# Altium schematic sheet LED_PORT.SchDoc
size A; DocumentNumber: 6; SheetNumber: 6; SheetTotal: 7
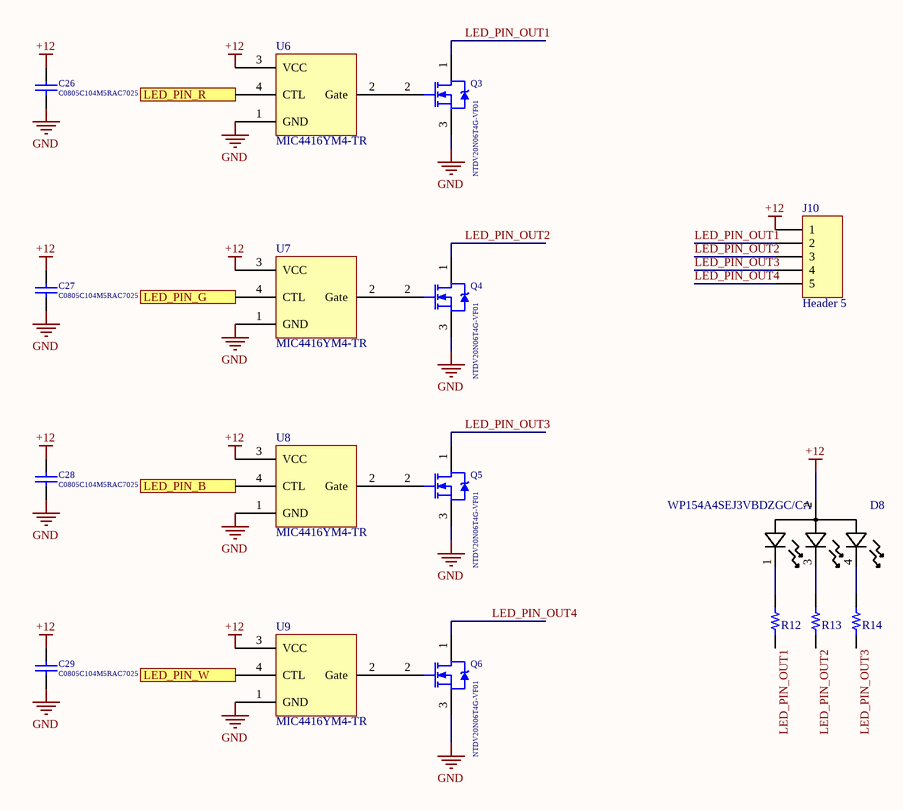
[diagram p0: LED_PORT.SchDoc]

## Parts
C26  C0805C104M5RAC7025  [CAP SMD 0805]
C27  C0805C104M5RAC7025  [CAP SMD 0805]
C28  C0805C104M5RAC7025  [CAP SMD 0805]
C29  C0805C104M5RAC7025  [CAP SMD 0805]
D8  WP154A4SEJ3VBDZGC/CA  [LED_RGB_5MM]
J10  Header 5  [CONN. 5]
Q3  NTDV20N06T4G-VF01  [DPAK228P991X238-3N]
Q4  NTDV20N06T4G-VF01  [DPAK228P991X238-3N]
Q5  NTDV20N06T4G-VF01  [DPAK228P991X238-3N]
Q6  NTDV20N06T4G-VF01  [DPAK228P991X238-3N]
R12  1k  [RES SMD 0805]  (value not drawn)
R13  1K  [RES SMD 0805]  (value not drawn)
R14  1K  [RES SMD 0805]  (value not drawn)
U6  MIC4416YM4-TR  [MICROCHIP SOT-143-4]
U7  MIC4416YM4-TR  [MICROCHIP SOT-143-4]
U8  MIC4416YM4-TR  [MICROCHIP SOT-143-4]
U9  MIC4416YM4-TR  [MICROCHIP SOT-143-4]

## Ports
LED_PIN_B (in), LED_PIN_G (in), LED_PIN_R (in), LED_PIN_W (in)

## Nets
+12: C26.2 C27.2 C28.2 C29.2 D8.2 J10.1 U6.3(VCC) U7.3(VCC) U8.3(VCC) U9.3(VCC)
GND: C26.1 C27.1 C28.1 C29.1 Q3.3(S) Q4.3(S) Q5.3(S) Q6.3(S) U6.1(GND) U7.1(GND) U8.1(GND) U9.1(GND)
LED_PIN_B: U8.4(CTL) ; port LED_PIN_B
LED_PIN_G: U7.4(CTL) ; port LED_PIN_G
LED_PIN_OUT1: J10.2 Q3.1(D) R12.1
LED_PIN_OUT2: J10.3 Q4.1(D) R13.1
LED_PIN_OUT3: J10.4 Q5.1(D) R14.1
LED_PIN_OUT4: J10.5 Q6.1(D)
LED_PIN_R: U6.4(CTL) ; port LED_PIN_R
LED_PIN_W: U9.4(CTL) ; port LED_PIN_W
NetD8_1: D8.1 R12.2
NetD8_3: D8.3 R13.2
NetD8_4: D8.4 R14.2
NetQ3_2: Q3.2(G) U6.2(Gate)
NetQ4_2: Q4.2(G) U7.2(Gate)
NetQ5_2: Q5.2(G) U8.2(Gate)
NetQ6_2: Q6.2(G) U9.2(Gate)

## Library data of the parts
C26-C29 = Cap_3_1: 0.1 µF ±20% 50V Ceramic Capacitor X7R 0805 (2012 Metric); Value: 0.1uF; Published: 8-Jun-2000; LatestRevisionDate: 17-Jul-2002; LatestRevisionNote: Re-released for DXP Platform.; PackageReference: RAD-0.3; Publisher: Altium Limited; PackageDescription: Radial Cap, Thru-Hole; 2 Leads; 0.3 in Pin Spacing
D8 = WP154A4SEJ3VBDZGC/CA: 5mm RGB Tri-Color Round Lamp; Mfr_Name: Kingbright; Type: DEV; Copyright: Copyright (C) 2022 Ultra Librarian. All rights reserved.; Manufacturer_Part_Number: WP154A4SEJ3VBDZGC/CA; Digi-Key_Part_Number_1: 754-2153-ND; Digi-Key_Part_Number_2: 754-2153-NDL; RefDes: RefDes
J10 = TermBlock 5: 5 Position Terminal Block Header, Male Pins, Shrouded (2 Side) 0.197" (5.00mm) 90°, Right Angle - Through Hole; LatestRevisionDate: 17-Jul-2002; LatestRevisionNote: Re-released for DXP Platform.; Publisher: Altium Limited
Q3-Q6 = IRF540NS: MOSFET N-CH 60V 20A DPAK; Manufacture: ON Semiconductor; Manufacture Part Number: IRF540N_R4942; Published: 8-Jun-2000; LatestRevisionDate: 20-Nov-2009; LatestRevisionNote: IPC-7351 Footprint Added.; DatasheetVersion: May-1998; PackageReference: TO-220AB; Publisher: Altium Limited; PackageDescription: TO, Thru-Hole, Vertical, Heatsink Mounted; 3 In-Line Leads; Pitch 2.54 mm; ComponentLink1Description: Manufacturer Link; ComponentLink1URL: http://www.irf.com/; ComponentLink2Description: Datasheet; ComponentLink2URL: http://www.irf.com/product-info/datasheets/data/irf540ns.pdf; Supplier: Local; Supplier Part Number: IRF540N
R12 = RESISTOR: RES SMD 1k OHM 1% 1/4W 0805
R13 R14 = RESISTOR_2: RES SMD 1K OHM 1% 1/4W 0805
U6-U9 = MIC4416YM4-TR: IC GATE DRVR LOW-SIDE SOT143; Manufacturer: Microchip Technology; Channel Type: Single; Current - Peak Output (Source, Sink): 1.2A, 1.2A; Gate Type: N-Channel MOSFET; Input Type: Non-Inverting; Logic Voltage - VIL, VIH: 0.8V, 2.4V; Number of Drivers: 1; Rise / Fall Time (Typ): 14ns, 16ns; Voltage - Supply: 4.5V ~ 18V; Part Number: MIC4416YM4-TR; ComponentLink1Description: Datasheet; ComponentLink1URL: http://www.microchip.com/mymicrochip/filehandler.aspx?ddocname=en579163; ComponentLink2Description: DigiKey Link; ComponentLink2URL: http://digikey.com/product-detail/en/microchip-technology/MIC4416YM4-TR/576-1187-1-ND/771864; Device Package: TO-253-4, TO-253AA; Driven Configuration: Low-Side; LastUpdated: 31/01/2020 01:32:45; Lifecycle Status: Active; Minimum Order: 1; Mounting Type: Surface Mount; Operating Temperature: -40°C ~ 150°C (TJ); Package / Case: TO-253-4, TO-253AA; Packaging: TapeAndReel; PartId: 7; Part Status: Active; Price: 0.68; Series: IttyBitty®; Supplier 1: DigiKey; Supplier Part Number 1: 576-1187-1-ND; Supplier Device Package: SOT-143